# Altium schematic sheet Header-Male-2.54_1x4_2021-01-09.schdoc
size 41 x 35 mm
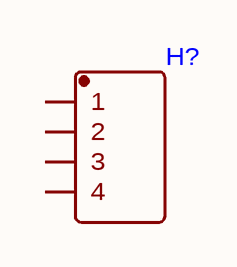
[diagram p0: Header-Male-2.54_1x4_2021-01-09.schdoc]

## Parts
H?  (no value)  [HDR-TH_4P-P2.54-V]

## Nets

Not connected (* = marked no-connect by the designer): H? 1 2 3 4

## Library data of the parts
H? = Header-Male-2.54_1x4